# Altium schematic sheet Switch.SchDoc
size A3; SheetNumber: 1; SheetTotal: 1
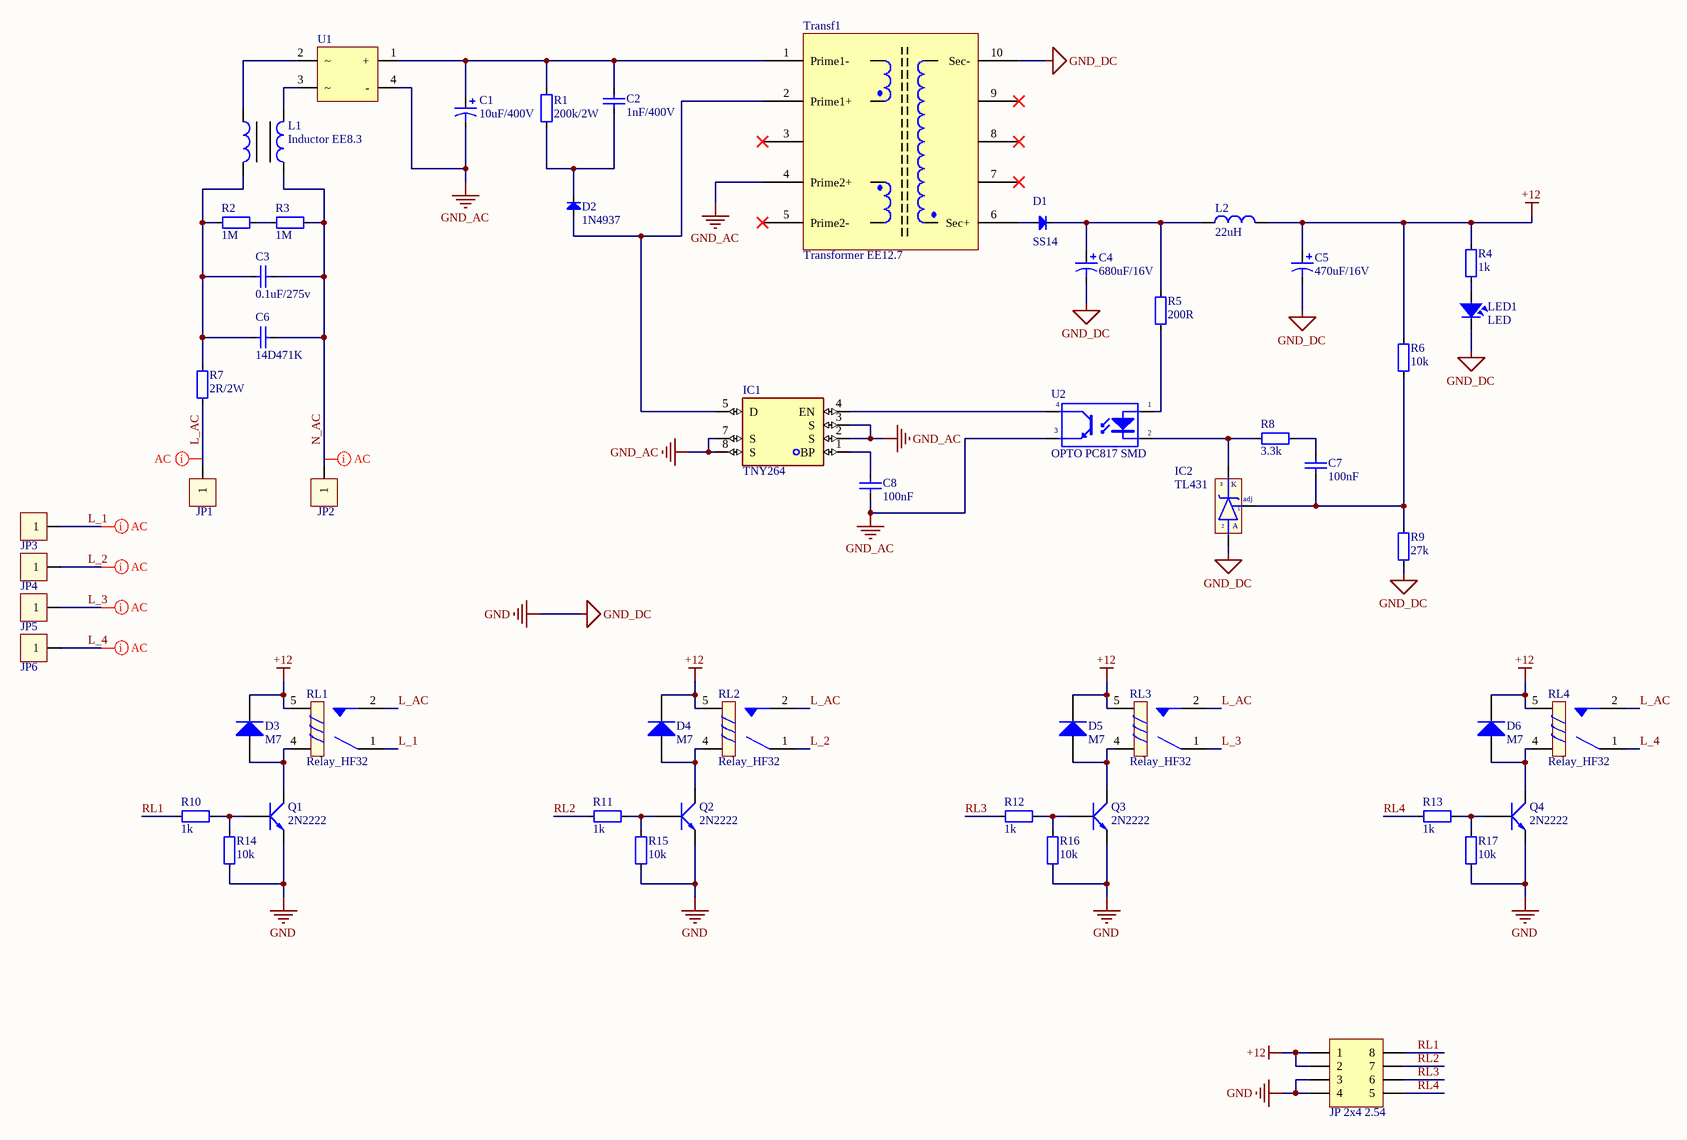
[diagram p0: Switch.SchDoc]

## Parts
C1  10uF/400V  [C10mm]
C2  1nF/400V  [103/2KV]
C3  0.1uF/275v  [Cap AC filter]
C4  680uF/16V  [C8mm]
C5  470uF/16V  [C8mm]
C6  14D471K  [103/2KV]
C7  100nF  [CAP_0603]
C8  100nF  [CAP_0603]
D1  SS14  [DO-214AC(SMA)]
D2  1N4937  [DIO-1AN]
D3  M7  [DIODE SMA]
D4  M7  [DIODE SMA]
D5  M7  [DIODE SMA]
D6  M7  [DIODE SMA]
IC1  TNY264  [TNY264]
IC2  TL431  [qto-92]
JP1  Coc_dong  [Coc_dong]  (value not drawn)
JP2  Coc_dong  [Coc_dong]  (value not drawn)
JP3  Coc_dong  [Coc_dong]  (value not drawn)
JP4  Coc_dong  [Coc_dong]  (value not drawn)
JP5  Coc_dong  [Coc_dong]  (value not drawn)
JP6  Coc_dong  [Coc_dong]  (value not drawn)
JP7  JP 2x4 2.54  [JP 2x4 DT]
L1  Inductor EE8.3  [Inductor EE8.3]
L2  22uH  [L_SMD]
LED1  LED  [LED-0805-Red]
Q1  2N2222  [SOT23]
Q2  2N2222  [SOT23]
Q3  2N2222  [SOT23]
Q4  2N2222  [SOT23]
R1  200k/2W  [RES-1WW]
R2  1M  [RES-SMD-1206]
R3  1M  [RES-SMD-1206]
R4  1k  [RES-SMD-0603]
R5  200R  [RES-SMD-0603]
R6  10k  [RES-SMD-0603]
R7  2R/2W  [RES-1WW]
R8  3.3k  [RES-SMD-0603]
R9  27k  [RES-SMD-0603]
R10  1k  [RES-SMD-0603]
R11  1k  [RES-SMD-0603]
R12  1k  [RES-SMD-0603]
R13  1k  [RES-SMD-0603]
R14  10k  [RES-SMD-0603]
R15  10k  [RES-SMD-0603]
R16  10k  [RES-SMD-0603]
R17  10k  [RES-SMD-0603]
RL1  Relay_HF32  [HF32F]
RL2  Relay_HF32  [HF32F]
RL3  Relay_HF32  [HF32F]
RL4  Relay_HF32  [HF32F]
Transf1  Transformer EE12.7  [Transformer EE12.7]
U1  Diode Bridge Flate  [DB207S]  (value not drawn)
U2  OPTO PC817 SMD  [SOP4]

## Nets
+12: C5.1 D3.2(K) D4.2(K) D5.2(K) D6.2(K) JP7.1 JP7.2 L2.2 R4.2 R6.2 RL1.5 RL2.5 RL3.5 RL4.5
GND: C4.2 C5.2 IC2.2(A) JP7.3 JP7.4 LED1.2 Q1.2(E) Q2.2(E) Q3.2(E) Q4.2(E) R9.1 R14.1 R15.1 R16.1 R17.1 Transf1.10(Sec-)  [also labelled GND_DC]
GND_AC: C1.2 C8.1 IC1.2(S) IC1.3(S) IC1.7(S) IC1.8(S) Transf1.4(Prime2+) U1.4(-) U2.3(E)
L_1: JP3.1 RL1.1
L_2: JP4.1 RL2.1
L_3: JP5.1 RL3.1
L_4: JP6.1 RL4.1
L_AC: JP1.1 R7.1 RL1.2 RL2.2 RL3.2 RL4.2
N_AC: C3.1 C6.1 JP2.1 L1.1 R3.1
RL1: JP7.8 R10.1
RL2: JP7.7 R11.1
RL3: JP7.6 R12.1
RL4: JP7.5 R13.1
NetC1_1: C1.1 C2.1 R1.2 Transf1.1(Prime1-) U1.1(+)
NetC2_2: C2.2 D2.2(K) R1.1
NetC3_2: C3.2 C6.2 L1.3 R2.2 R7.2
NetC4_1: C4.1 D1.2(K) L2.1 R5.2
NetC7_1: C7.1 IC2.1(adj) R6.1 R9.2
NetC7_2: C7.2 R8.1
NetC8_2: C8.2 IC1.1(BP)
NetD1_1: D1.1(A) Transf1.6(Sec+)
NetD2_1: D2.1(A) IC1.5(D) Transf1.2(Prime1+)
NetD3_1: D3.1(A) Q1.3(C) RL1.4
NetD4_1: D4.1(A) Q2.3(C) RL2.4
NetD5_1: D5.1(A) Q3.3(C) RL3.4
NetD6_1: D6.1(A) Q4.3(C) RL4.4
NetIC1_4: IC1.4(EN) U2.4(C)
NetIC2_3: IC2.3(K) R8.2 U2.2(K)
NetL1_2: L1.2 U1.3
NetL1_4: L1.4 U1.2
NetLED1_1: LED1.1 R4.1
NetQ1_1: Q1.1(B) R10.2 R14.2
NetQ2_1: Q2.1(B) R11.2 R15.2
NetQ3_1: Q3.1(B) R12.2 R16.2
NetQ4_1: Q4.1(B) R13.2 R17.2
NetR2_1: R2.1 R3.2
NetR5_1: R5.1 U2.1(A)

Not connected (* = marked no-connect by the designer): Transf1 3* 5(Prime2-)* 7* 8* 9*

## Layout directives
net class AC: L_1, L_2, L_3, L_4, L_AC, N_AC

## Library data of the parts
C1 C4 C5 = Cap Pol: Polarized Capacitor (Axial); Published: 8-Jun-2000; LatestRevisionDate: 17-Jul-2002; LatestRevisionNote: Re-released for DXP Platform.; PackageReference: POLAR0.8; Publisher: Altium Limited
C2 = Cap2KV: CAP CERAMIC; Published: 8-Jun-2000; LatestRevisionDate: 17-Jul-2002; LatestRevisionNote: Re-released for DXP Platform.; PackageReference: RAD-0.3; Publisher: Altium Limited
C3 = Cap AC filter: Tụ lọc nguồn AC 0.1uf 275v 10mm
C6 = Cap2KV: Capacitor Ceramic 2KV; Published: 8-Jun-2000; LatestRevisionDate: 17-Jul-2002; LatestRevisionNote: Re-released for DXP Platform.; PackageReference: RAD-0.3; Publisher: Altium Limited
C7 C8 = CapSMD: Capacitor; Value: 33p; Published: 8-Jun-2000; LatestRevisionDate: 17-Jul-2002; LatestRevisionNote: Re-released for DXP Platform.; PackageReference: RAD-0.3; Publisher: Altium Limited
D1 = Diode SMD: Diode Schottky / 1N5819; Code - JEDEC: DO-214-AB; Value: 1N5007; Published: 8-Jun-2000; Revision: July-2002: Re-released for DXP Platform.; Publisher: Altium Limited
D2 = Diode SMD: Diode Schottky / 1N4937; Code - JEDEC: DO-214-AB; Value: 1N5007; Published: 8-Jun-2000; Revision: July-2002: Re-released for DXP Platform.; Publisher: Altium Limited
D3-D6 = Diode M7 ( 4007 ): Dán; Don_Vi: Con; Ten_Linh_Kien: Diode M7 1N4007 SMD 1A 1000V; Ma_Hang: MH000944; Chung_Loai: Dán; Ghi_Chu: *
IC1 = TNY264: IC Power
IC2 = TL431: Programmable Shunt Regulator; Value: TL431
JP7 = JP 2x4 2.54 Duc Thang: Cắm; Ten_Linh_Kien: Jump Đôi Đực 2.54MM 2x40P Thẳng 11MM; Don_Vi: Con; Ma_Hang: MH002686; Ghi_Chu: *; Kieu_Chan: *; Chung_Loai: Cắm
L2 = Inductor: CD73R 22uH 1.23A 7345; Value: 150 mH
LED1 = LED: LED Single colour Green and Red; Value: LED 3 ly Single Colour
Q1-Q4 = C1815 HF SMD: NPN transistor; Value: C9014
R1-R17 = Resistor - SMD: Resistor; Manufacturer: Generic Components; Class: Passive; Published: 08/06/2000; Publisher: Altium Hobart Technology Centre
Transf1 = Tranformer EE16
U1 = Diode Bridge Flate: Diode Bridge
U2 = OPTO PC817 SMD: Single Opto; Value: PC817